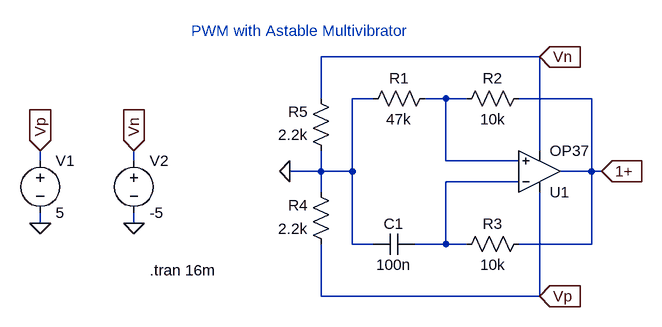
[diagram p0: schematic pwm_astable_multivibr_ltspice.asc]
pwm_astable_multivibr_ltspice.asc, the LTspice schematic file:
Version 4
SHEET 1 932 888
WIRE 400 288 64 288
WIRE 64 352 64 288
WIRE 144 352 112 352
WIRE 256 352 224 352
WIRE 288 352 256 352
WIRE 480 352 368 352
WIRE 400 432 400 288
WIRE -368 448 -368 432
WIRE -224 448 -224 432
WIRE 256 448 256 352
WIRE 368 448 256 448
WIRE 64 464 64 432
WIRE 64 464 16 464
WIRE 112 464 112 352
WIRE 112 464 64 464
WIRE 480 464 480 352
WIRE 480 464 432 464
WIRE 496 464 480 464
WIRE 368 480 256 480
WIRE 64 496 64 464
WIRE -368 544 -368 528
WIRE -224 544 -224 528
WIRE 112 576 112 464
WIRE 144 576 112 576
WIRE 256 576 256 480
WIRE 256 576 208 576
WIRE 288 576 256 576
WIRE 480 576 480 464
WIRE 480 576 368 576
WIRE 64 656 64 576
WIRE 400 656 400 496
WIRE 400 656 64 656
FLAG -368 544 0
FLAG -224 544 0
FLAG -368 432 Vp
IOPIN -368 432 In
FLAG -224 432 Vn
IOPIN -224 432 In
FLAG 16 464 0
FLAG 400 288 Vn
IOPIN 400 288 In
FLAG 400 656 Vp
IOPIN 400 656 In
FLAG 496 464 1+
IOPIN 496 464 In
SYMBOL Opamps\\OP37 400 528 M180
SYMATTR InstName U1
SYMBOL voltage -368 432 R0
WINDOW 123 0 0 Left 0
WINDOW 39 0 0 Left 0
SYMATTR InstName V1
SYMATTR Value 5
SYMBOL voltage -224 432 R0
WINDOW 123 0 0 Left 0
WINDOW 39 0 0 Left 0
SYMATTR InstName V2
SYMATTR Value -5
SYMBOL res 240 336 R90
WINDOW 0 0 56 VBottom 2
WINDOW 3 32 56 VTop 2
SYMATTR InstName R1
SYMATTR Value 47k
SYMBOL res 384 336 R90
WINDOW 0 0 56 VBottom 2
WINDOW 3 32 56 VTop 2
SYMATTR InstName R2
SYMATTR Value 10k
SYMBOL res 384 560 R90
WINDOW 0 0 56 VBottom 2
WINDOW 3 32 56 VTop 2
SYMATTR InstName R3
SYMATTR Value 10k
SYMBOL res 80 448 R180
WINDOW 0 36 76 Left 2
WINDOW 3 36 40 Left 2
SYMATTR InstName R5
SYMATTR Value 2.2k
SYMBOL res 80 592 R180
WINDOW 0 36 76 Left 2
WINDOW 3 36 40 Left 2
SYMATTR InstName R4
SYMATTR Value 2.2k
SYMBOL cap 208 560 R90
WINDOW 0 0 32 VBottom 2
WINDOW 3 32 32 VTop 2
SYMATTR InstName C1
SYMATTR Value 100n
TEXT -136 248 Left 2 ;PWM with Astable Multivibrator
TEXT -200 616 Left 2 !.tran 16m

The netlist it stands for:
* pwm_astable_multivibr_ltspice.asc
XU1 N001 N002 Vp Vn 1+ LT1037  ; OP37, pins In+ In- V+ V- OUT
V1 Vp 0 5
V2 Vn 0 -5
R1 N001 0 47k
R2 1+ N001 10k
R3 1+ N002 10k
R5 0 Vn 2.2k
R4 Vp 0 2.2k
C1 N002 0 100n
* PWM with Astable Multivibrator
.tran 16m
.lib LTC.lib
.backanno
.end